# Altium schematic sheet [7]- ADC Chip.SchDoc: Mixed Signal Board
size A4; Author: AVIRAL MISHRA; DocumentNumber: 7; SheetNumber: 7; SheetTotal: 11; PROJECT CODE: A_V1.0
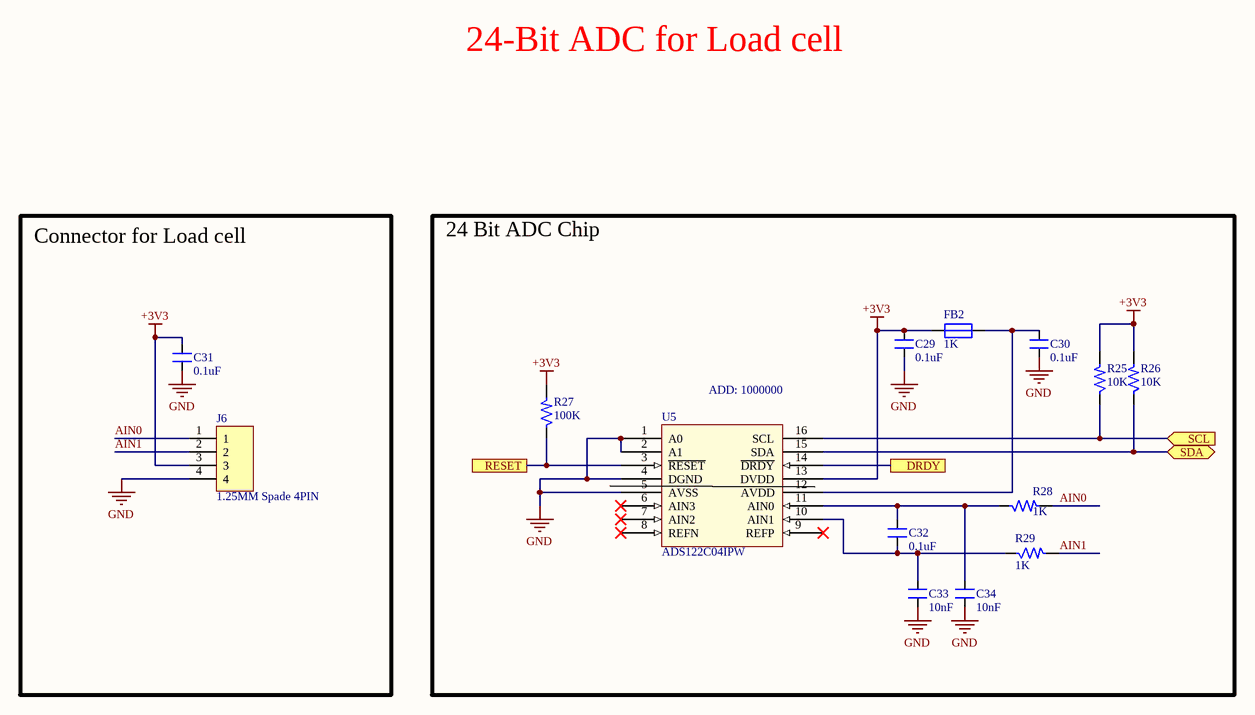
[diagram p0: [7]- ADC Chip.SchDoc]

## Parts
C29  0.1uF  [CAP_0805]
C30  0.1uF  [CAP_0805]
C31  0.1uF  [CAP_0805]
C32  0.1uF  [CAP_0805]
C33  10nF  [CAP_0805]
C34  10nF  [CAP_0805]
FB2  1K  [IND_0805]
J6  1.25MM Spade 4PIN  [CON4_50_653004117322_TH_RA]
R25  10K  [RES_0603]
R26  10K  [RES_0603]
R27  100K  [RES_0603]
R28  1K  [RES_0603]
R29  1K  [RES_0603]
U5  ADS122C04IPW  [TSSOP16_25-59_294_54X14_SMT]

## Blocks framed on the sheet
Connector for Load cell: C31 J6
24 Bit ADC Chip: C29 C30 C32-C34 FB2 R25-R29 U5

## Ports
DRDY, RESET, SCL (in), SDA (bidir)

## Nets
+3V3: C29.2 C31.2 FB2.1 J6.3 R25.2 R26.2 R27.2 U5.13(DVDD)
GND: C29.1 C30.1 C31.1 C33.1 C34.1 J6.4 U5.1(A0) U5.2(A1) U5.4(DGND) U5.5(AVSS)
AIN0: J6.1 R28.2
AIN1: J6.2 R29.2
DRDY: U5.14(~{DRDY}) ; port DRDY
RESET: R27.1 U5.3(~{RESET}) ; port RESET
SCL: R25.1 U5.16(SCL) ; port SCL
SDA: R26.1 U5.15(SDA) ; port SDA
NetC30_2: C30.2 FB2.2 U5.12(AVDD)
NetC32_1: C32.1 C33.2 R29.1 U5.10(AIN1)
NetC32_2: C32.2 C34.2 R28.1 U5.11(AIN0)

Not connected (* = marked no-connect by the designer): U5 6(AIN3)* 7(AIN2)* 8(REFN)* 9(REFP)*

## Notes on the sheet
- 24-Bit ADC for Load cell
- (near U5) ADD: 1000000
- TITLE:
- DOCUMENT NAME:
- SCALE 1:1
- This document is copyright of EsteemPCB and shall not be revealed, produced, copied, in whole or in part, nor
- PROJECT CODE:
- TEMPLATE:
- A4
- AUTHOR:
- Sheet
- of
- used for any purpose other than submitted.

## Library data of the parts
C29-C32 = CAP_0.1uF-50V-10%-0805: 0.1µF ±10% 50V Ceramic Capacitor X7R 0805 (2012 Metric) /; Manufacturer: Samsung; Manufacturer Part Number: CL21B104KBCNNNC; Alternate Part Number-1: NA; Case/Package: 0805; Supplier-1: SIRICOM; Supplier Part Number-1: 0805B104K500CT
C33 C34 = CAP_10nF-50V-10%-0805: 10000pF ±10% 50V Ceramic Capacitor X7R 0805 (2012 Metric) /; Manufacturer: Samsung; Manufacturer Part Number: C0805C103K5RECAUTO; Alternate Part Number-1: GRM2195C1H103JA01D; Case/Package: 0805; Supplier-1: SIRICOM; Supplier Part Number-1: 0805B103K500CT
FB2 = FB_1K-100MHZ-1.6A-0805: 1 kOhms @ 100MHz 1 Power Line Ferrite Bead 0805 (2012 Metric) 1.6A; Manufacturer: Laird; Manufacturer Part Number: BLM21SP102SH1D; Alternate Part Number-1: NA; Case/Package: 0805; Supplier-1: SIRICOM; Supplier Part Number-1: ACMS201209A102
J6 = CON-PLG_4X1-50-RA-TH: 4 Pins, 1 Row 1.25mm Pitch, right angle Connector, male; Manufacturer Part Number: 653004117322; Manufacturer: JST; Mating Part Number: 653004113322; Crimp Part Number: 653153128130; Alternate Part Number-1: NA; Case/Package: TH-CON; Supplier-1: WURTH; Supplier Part Number-1: 653004117322
R25 R26 = RES_10K-0.1W-1%-0603: 10 kOhms ±1% 0.1W, 1/10W Chip Resistor 0603 (1608 Metric) Automotive AEC-Q200 Thick Film /; Manufacturer: Walsin; Manufacturer Part Number: WR06X1002FTL; Alternate Part Number-1: 0603WAJ0103T5E; Case/Package: 0603; Supplier-1: SIRICOM; Supplier Part Number-1: WR06X1002FTL
R27 = RES_100K-0.1W-1%-0603: 100 kOhms ±1% 0.1W, 1/10W Chip Resistor 0603 (1608 Metric) Automotive AEC-Q200 Thick Film /; Manufacturer: Stackpole Electronics; Manufacturer Part Number: RMCF0603FT100K; Alternate Part Number-1: NA; Case/Package: 0603; Supplier-1: Arrow; Supplier Part Number-1: RMCF0603FT100K
R28 R29 = RES_1K-0.1W-1%-0603: 1 kOhms ±1% 0.1W, 1/10W Chip Resistor 0603 (1608 Metric) Automotive AEC-Q200 Thick Film /; Manufacturer: Walsin; Manufacturer Part Number: WR06X1001FTL; Alternate Part Number-1: 0603WAF1001T5E; Case/Package: 0603; Supplier-1: SIRICOM; Supplier Part Number-1: WR06X1001FTL
U5 = IC_ADS122C04IPW: 24 Bit Analog to Digital Converter 4 Input 1 Sigma-Delta 16-TSSOP; Manufacturer: Texas Instruments; Alternate Part Number-1: NA; Manufacturer Part Number: ADS122C04IPW; Case/Package: TSSOP16; Supplier-1: MOUSER; Supplier Part Number-1: ADS122C04IPW